# Altium schematic sheet STM32.SchDoc
size A4
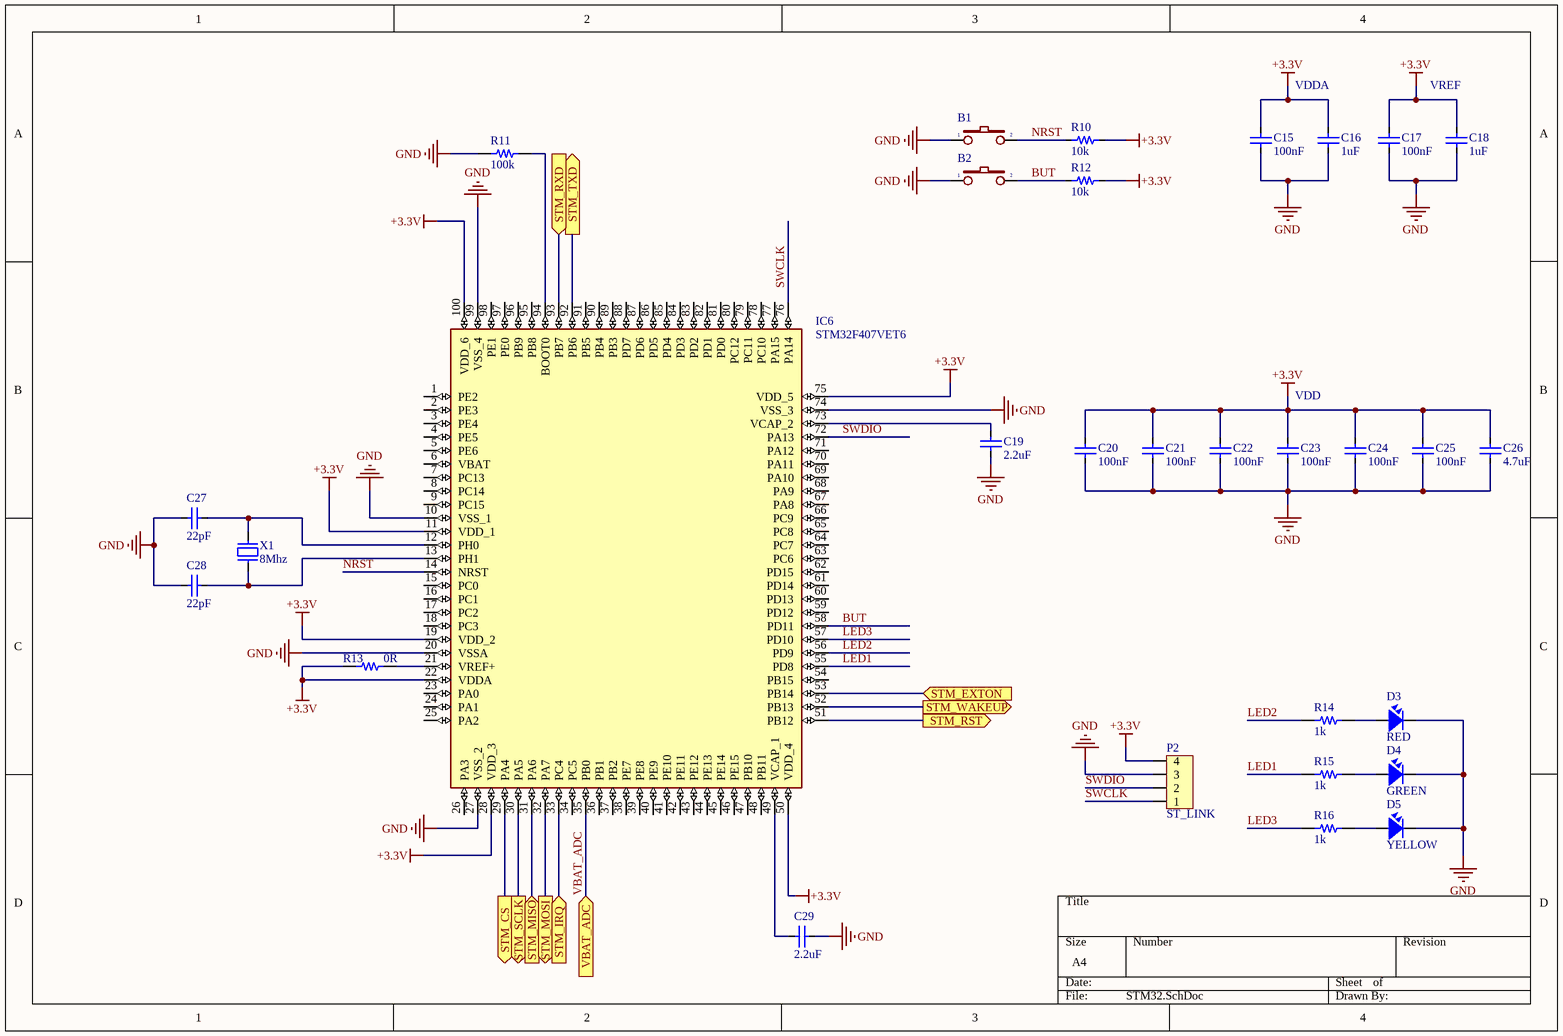
[diagram p0: STM32.SchDoc]

## Parts
B1  Button 3x4x2.5  [Button 3x4x2.5]  (value not drawn)
B2  Button 3x4x2.5  [BUTTON NGHIENG]  (value not drawn)
C15  100nF  [CAP_0603]
C16  1uF  [CAP_0603]
C17  100nF  [CAP_0603]
C18  1uF  [CAP_0603]
C19  2.2uF  [CAP_0603]
C20  100nF  [CAP_0603]
C21  100nF  [CAP_0603]
C22  100nF  [CAP_0603]
C23  100nF  [CAP_0603]
C24  100nF  [CAP_0603]
C25  100nF  [CAP_0603]
C26  4.7uF  [CAP_0603]
C27  22pF  [CAP_0603]
C28  22pF  [CAP_0603]
C29  2.2uF  [CAP_0603]
D3  RED  [LED-0603-Red]
D4  GREEN  [LED-0603-Green]
D5  YELLOW  [LED-0603-Red]
IC6  STM32F407VET6  [STM32F407VET6]
P2  ST_LINK  [HEADER4P-1.25]
R10  10k  [RES-SMD-0603]
R11  100k  [RES-SMD-0603]
R12  10k  [RES-SMD-0603]
R13  0R  [RES-SMD-0603]
R14  1k  [RES-SMD-0603]
R15  1k  [RES-SMD-0603]
R16  1k  [RES-SMD-0603]
X1  8Mhz  [XTAL 5032 SMD]

## Ports
STM_CS (out), STM_EXTON (in), STM_IRQ (in), STM_MISO (in), STM_MOSI (out), STM_RST (out), STM_RXD (in), STM_SCLK (out), STM_TXD (out), STM_WAKEUP (out), VBAT_ADC (in)

## Nets
+3.3V: C15.2 C16.2 C17.2 C18.2 C20.2 C21.2 C22.2 C23.2 C24.2 C25.2 C26.2 IC6.11(VDD_1) IC6.19(VDD_2) IC6.22(VDDA) IC6.28(VDD_3) IC6.50(VDD_4) IC6.75(VDD_5) IC6.100(VDD_6) P2.4 R10.1 R12.1 R13.2
GND: B1.1 B2.1 C15.1 C16.1 C17.1 C18.1 C19.2 C20.1 C21.1 C22.1 C23.1 C24.1 C25.1 C26.1 C27.1 C28.1 C29.2 D3.2 D4.2 D5.2 IC6.10(VSS_1) IC6.20(VSSA) IC6.27(VSS_2) IC6.74(VSS_3) IC6.99(VSS_4) P2.3 R11.1
BUT: B2.2 IC6.58(PD11) R12.2
LED1: IC6.55(PD8) R15.2
LED2: IC6.56(PD9) R14.2
LED3: IC6.57(PD10) R16.2
NRST: B1.2 IC6.14(NRST) R10.2
STM_CS: IC6.29(PA4) ; port STM_CS
STM_EXTON: IC6.53(PB14) ; port STM_EXTON
STM_IRQ: IC6.33(PC4) ; port STM_IRQ
STM_MISO: IC6.31(PA6) ; port STM_MISO
STM_MOSI: IC6.32(PA7) ; port STM_MOSI
STM_RST: IC6.51(PB12) ; port STM_RST
STM_RXD: IC6.93(PB7) ; port STM_RXD
STM_SCLK: IC6.30(PA5) ; port STM_SCLK
STM_TXD: IC6.92(PB6) ; port STM_TXD
STM_WAKEUP: IC6.52(PB13) ; port STM_WAKEUP
SWCLK: IC6.76(PA14) P2.1
SWDIO: IC6.72(PA13) P2.2
VBAT_ADC: IC6.35(PB0) ; port VBAT_ADC
NetC19_1: C19.1 IC6.73(VCAP_2)
NetC27_2: C27.2 IC6.12(PH0) X1.1
NetC28_2: C28.2 IC6.13(PH1) X1.2
NetC29_1: C29.1 IC6.49(VCAP_1)
NetD3_1: D3.1 R14.1
NetD4_1: D4.1 R15.1
NetD5_1: D5.1 R16.1
NetIC6_21: IC6.21(VREF+) R13.1
NetIC6_94: IC6.94(BOOT0) R11.2

Not connected (* = marked no-connect by the designer): IC6 1(PE2) 2(PE3) 3(PE4) 4(PE5) 5(PE6) 6(VBAT) 7(PC13) 8(PC14) 9(PC15) 15(PC0) 16(PC1) 17(PC2) 18(PC3) 23(PA0) 24(PA1) 25(PA2) 26(PA3) 34(PC5) 36(PB1) 37(PB2) 38(PE7) 39(PE8) 40(PE9) 41(PE10) 42(PE11) 43(PE12) 44(PE13) 45(PE14) 46(PE15) 47(PB10) 48(PB11) 54(PB15) 59(PD12) 60(PD13) 61(PD14) 62(PD15) 63(PC6) 64(PC7) 65(PC8) 66(PC9) 67(PA8) 68(PA9) 69(PA10) 70(PA11) 71(PA12) 77(PA15) 78(PC10) 79(PC11) 80(PC12) 81(PD0) 82(PD1) 83(PD2) 84(PD3) 85(PD4) 86(PD5) 87(PD6) 88(PD7) 89(PB3) 90(PB4) 91(PB5) 95(PB8) 96(PB9) 97(PE0) 98(PE1)

## Notes on the sheet
- VDDA
- VREF
- VDD

## Library data of the parts
C15-C29 = CapSMD: Capacitor; Value: 33p; Published: 8-Jun-2000; LatestRevisionDate: 17-Jul-2002; LatestRevisionNote: Re-released for DXP Platform.; PackageReference: RAD-0.3; Publisher: Altium Limited
D3-D5 = LED: LED Single colour Green and Red; Value: LED 3 ly Single Colour
P2 = Header4: Header IDC, 4 x 1 Pin Vertical 2.54mm Pitch (Non-Boxed, Male); Manufacturer: W¨¹rth Elektronik eiSos GmbH; partNo: 613002143121; ComponentLink1 Description: Manufacturer; ComponentLink2 Description: Datasheet; NoPins: 02; Created Date: 29 March 2013; ComponentLink1URL: http://www.we-online.com; ComponentLink2URL: http://katalog.we-online.de/em/datasheet/6130xx143121.pdf; Created by: Karrer Zheng
R10-R16 = Resistor - SMD: Resistor; Manufacturer: Generic Components; Class: Passive; Published: 08/06/2000; Publisher: Altium Hobart Technology Centre
X1 = XT2: Crystal For all Crystal 2pin.; Value: 4Mhz